# EAGLE design Croduino Pico (EAGLE 7.3.0)
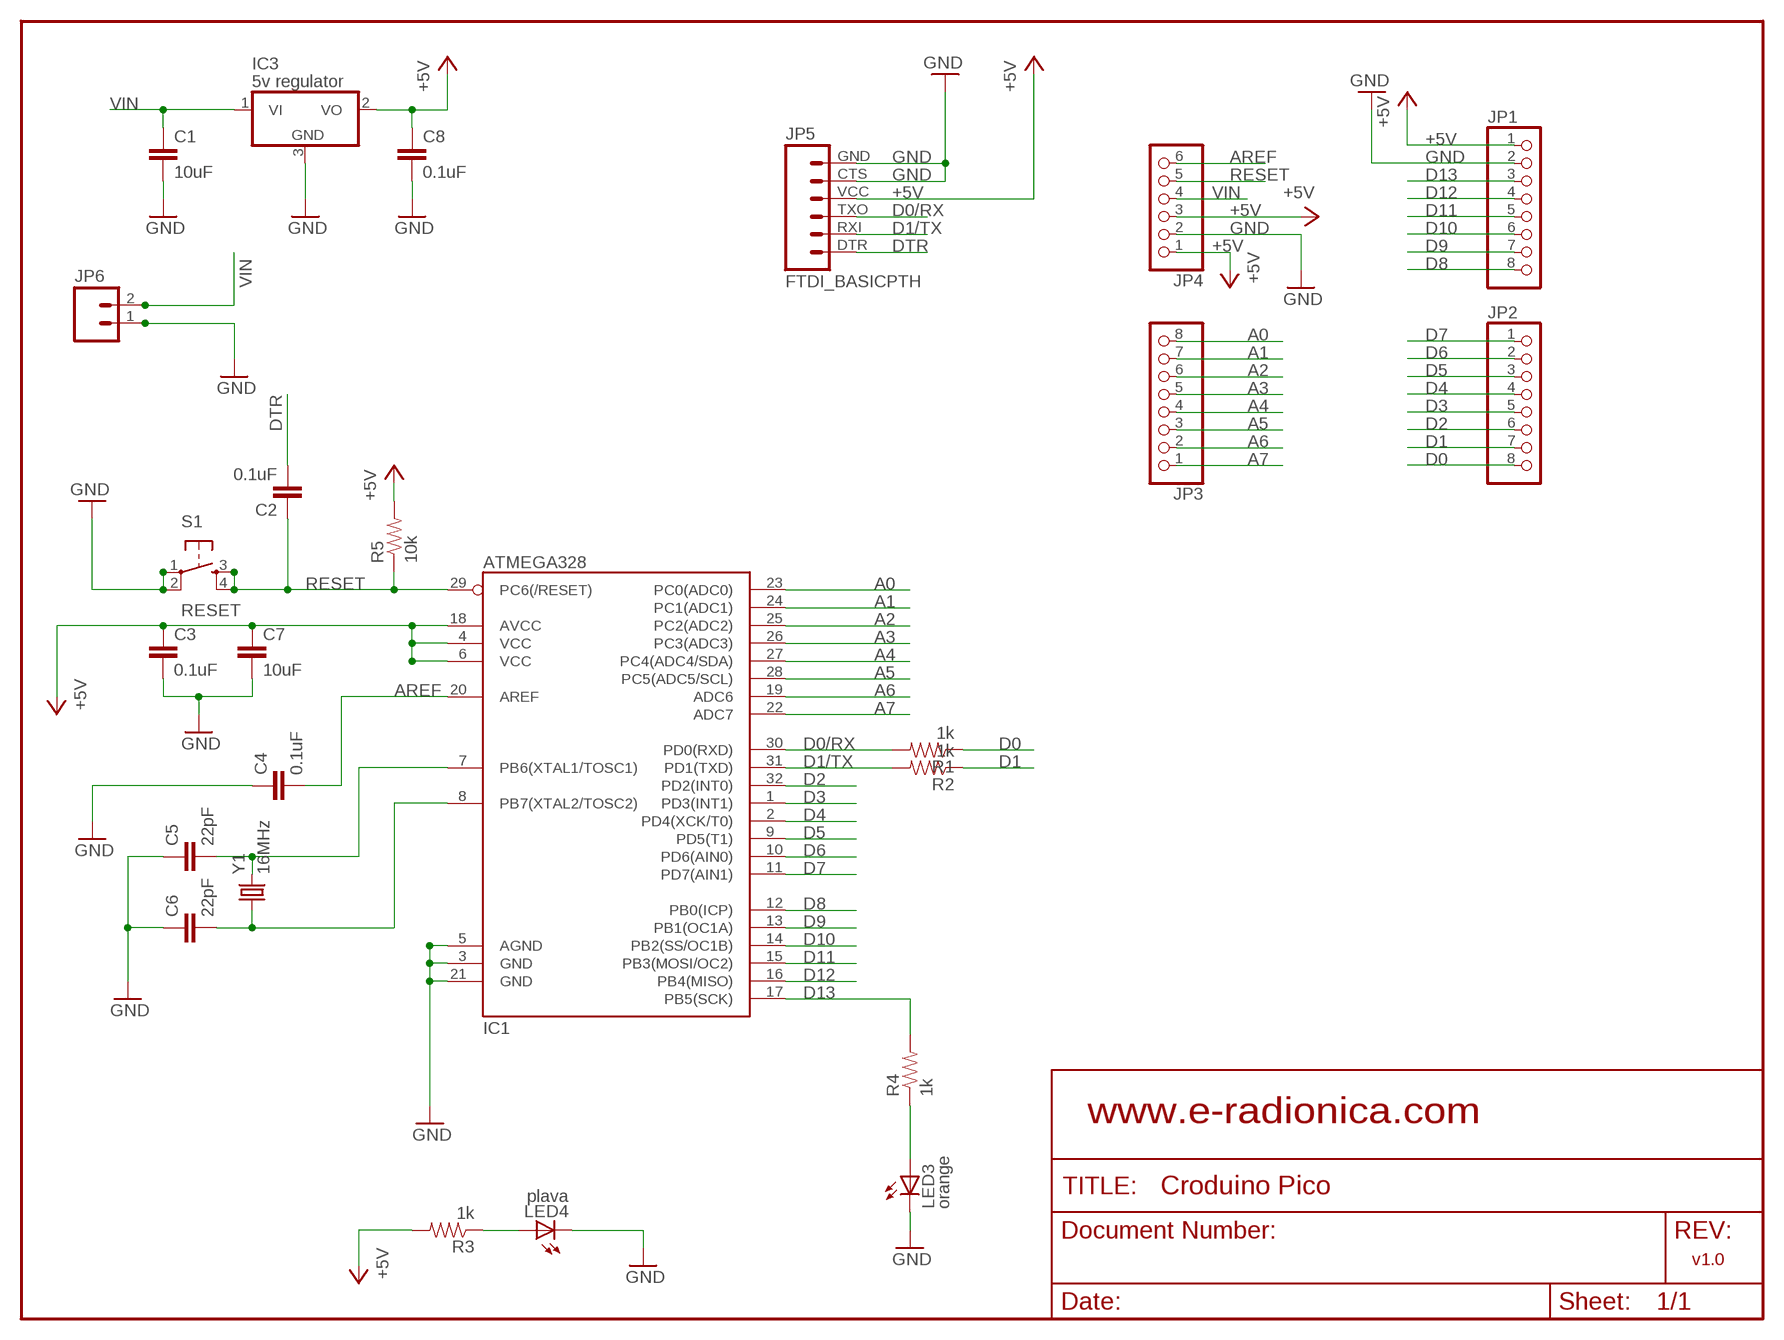
[diagram p0: schematic, sheet 1]

## Parts
C1  10uF  C-EUC3216  [C3216]
C2  0.1uF  CAP0603-CAP  [0603-CAP]
C3  0.1uF  CAP0603-CAP  [0603-CAP]
C4  0.1uF  CAP0603-CAP  [0603-CAP]
C5  22pF  CAP0603-CAP  [0603-CAP]
C6  22pF  CAP0603-CAP  [0603-CAP]
C7  10uF  C-EUC3216  [C3216]
C8  0.1uF  CAP0603-CAP  [0603-CAP]
IC1  ATMEGA328  ATMEGA168  [TQFP32-08]
IC3  5v regulator  7805DT  [TO252]
JP1  PINHD-1X8BIG  [1X08-BIG]
JP2  PINHD-1X8BIG  [1X08-BIG]
JP3  PINHD-1X8BIG  [1X08-BIG]
JP4  PINHD-1X6B  [1X06-BIG]
JP5  FTDI_BASICPTH  [FTDI_BASIC]
JP6  M02LOCK_LONGPADS  [1X02_LOCK_LONGPADS]
LED3  orange  LEDCHIP-LED0805  [CHIP-LED0805]
LED4  plava  LEDCHIP-LED0805  [CHIP-LED0805]
R1  1k  RESISTOR0603-RES  [0603-RES]
R2  1k  RESISTOR0603-RES  [0603-RES]
R3  1k  RESISTOR0603-RES  [0603-RES]
R4  1k  RESISTOR0603-RES  [0603-RES]
R5  10k  RESISTOR0603-RES  [0603-RES]
S1  RESET  TAC_SWITCHSMD  [TACTILE_SWITCH_SMD]
Y1  16MHz  CRYSTAL5X3  [CRYSTAL-SMD-5X3]

## Nets
+5V: C3.1 C7.1 C8.1 IC1.4(VCC) IC1.6(VCC) IC1.18(AVCC) IC3.2(VO) JP1.1 JP4.1 JP4.3 JP5.VCC R3.2 R5.2
A0: IC1.23(PC0(ADC0)) JP3.8
A1: IC1.24(PC1(ADC1)) JP3.7
A2: IC1.25(PC2(ADC2)) JP3.6
A3: IC1.26(PC3(ADC3)) JP3.5
A4: IC1.27(PC4(ADC4/SDA)) JP3.4
A5: IC1.28(PC5(ADC5/SCL)) JP3.3
A6: IC1.19(ADC6) JP3.2
A7: IC1.22(ADC7) JP3.1
AREF: C4.2 IC1.20(AREF) JP4.6
CRYSTAL1: C5.2 IC1.7(PB6(XTAL1/TOSC1)) Y1.3
CRYSTAL2: C6.2 IC1.8(PB7(XTAL2/TOSC2)) Y1.1
D0: JP2.8 R1.1
D0/RX: IC1.30(PD0(RXD)) JP5.TXO R1.2
D1: JP2.7 R2.1
D1/TX: IC1.31(PD1(TXD)) JP5.RXI R2.2
D2: IC1.32(PD2(INT0)) JP2.6
D3: IC1.1(PD3(INT1)) JP2.5
D4: IC1.2(PD4(XCK/T0)) JP2.4
D5: IC1.9(PD5(T1)) JP2.3
D6: IC1.10(PD6(AIN0)) JP2.2
D7: IC1.11(PD7(AIN1)) JP2.1
D8: IC1.12(PB0(ICP)) JP1.8
D9: IC1.13(PB1(OC1A)) JP1.7
D10: IC1.14(PB2(SS/OC1B)) JP1.6
D11: IC1.15(PB3(MOSI/OC2)) JP1.5
D12: IC1.16(PB4(MISO)) JP1.4
D13: IC1.17(PB5(SCK)) JP1.3 R4.2
DTR: C2.2 JP5.DTR
GND: C1.2 C3.2 C4.1 C5.1 C6.1 C7.2 C8.2 IC1.3(GND) IC1.5(AGND) IC1.21(GND) IC3.3(GND) JP1.2 JP4.2 JP5.CTS JP5.GND JP6.1 LED3.C LED4.C S1.1 S1.2
N$4: LED3.A R4.1
N$7: LED4.A R3.1
RESET: C2.1 IC1.29(PC6(/RESET)) JP4.5 R5.1 S1.3 S1.4
VIN: C1.1 IC3.1(VI) JP4.4 JP6.2

## Notes on the sheet
- www.e-radionica.com
- v1.0

## Library data of the parts
C1 C7 = rcl:C-EU: CAPACITOR, European symbol
C2-C6 C8 = SparkFun:CAP: Capacitor Standard 0603 ceramic capacitor, and 0.1" leaded capacitor.
IC1 = SparkFun:ATMEGA168
IC3 = adafruit:78*: Positive VOLTAGE REGULATOR Added bigger pads to the TO-92 package
JP1-JP3 = adafruit:PINHD-1X8: PIN HEADER
JP4 = adafruit:PINHD-1X6: PIN HEADER
JP5 = SparkFun:FTDI_BASIC: FTDI Basic: 3.3V and 5V
JP6 = SparkFun:M02: Header 2 Standard 2-pin 0.1" header. Use with straight break away headers (SKU : PRT-00116), right angle break away headers (PRT-00553), swiss pins (PRT-00743), machine pins (PRT-00117), and female headers (PRT-00115). Molex polarized connector foot print use with SKU : PRT-08233 with associated crimp pins and housings.
LED3 LED4 = adafruit:LED: LED OSRAM: - CHIPLED LG R971, LG N971, LY N971, LG Q971, LY Q971, LO R971, LY R971 LH N974, LH R974 LS Q976, LO Q976, LY Q976 LO Q996 - Hyper CHIPLED LW Q18S LB Q993, LB Q99A, LB R99A - SideLED LS A670, LO A670, LY A670, LG A670, LP A670 LB A673, LV A673, LT A673, LW A673 LH A674 LY A675 LS A676, LA A676, LO A676, LY A676, LW A676 LS A679, LY A679, LG A679 - Hyper Micro SIDELED® LS Y876, LA Y876, LO Y876, LY Y876 LT Y87S - SmartLED LW L88C, LW L88S LB L89C, LB L89S, LG L890 LS L89K, LO L89K, LY L89K LS L896, LA L896, LO L896, LY L896 - TOPLED LS T670, LO T670, LY T670, LG T670, LP T670 LSG T670, LSP T670, LSY T670, LOP T670, LYG T670 LG T671, LOG T671, LSG T671 LB T673, LV T673, LT T673, LW T673 LH T674 LS T676, LA T676, LO T676, LY T676, LB T676, LH T676, LSB T676, LW T676 LB T67C, LV T67C, LT T67C, LS T67K, LO T67K, LY T67K, LW E67C LS E67B, LA E67B, LO E67B, LY E67B, LB E67C, LV E67C, LT E67C LW T67C LS T679, LY T679, LG T679 LS T770, LO T770, LY T770, LG T770, LP T770 LB T773, LV T773, LT T773, LW T773 LH T774 LS E675, LA E675, LY E675, LS T675 LS T776, LA T776, LO T776, LY T776, LB T776 LHGB T686 LT T68C, LB T68C - Hyper Mini TOPLED® LB M676 - Mini TOPLED Santana® LG M470 LS M47K, LO M47K, LY M47K Source: http://www.osram.convergy.de/
R1-R5 = SparkFun:RESISTOR: Resistor Basic schematic elements and footprints for 0603, 1206, and PTH resistors.
S1 = SparkFun:TAC_SWITCH: Momentary Switch Button commonly used for reset or general input. Spark Fun Electronics SKU : COM-00097
Y1 = SparkFun:CRYSTAL: Crystals Various standard crystals. Proven footprints. Spark Fun Electronics SKU : COM-00534

## Board
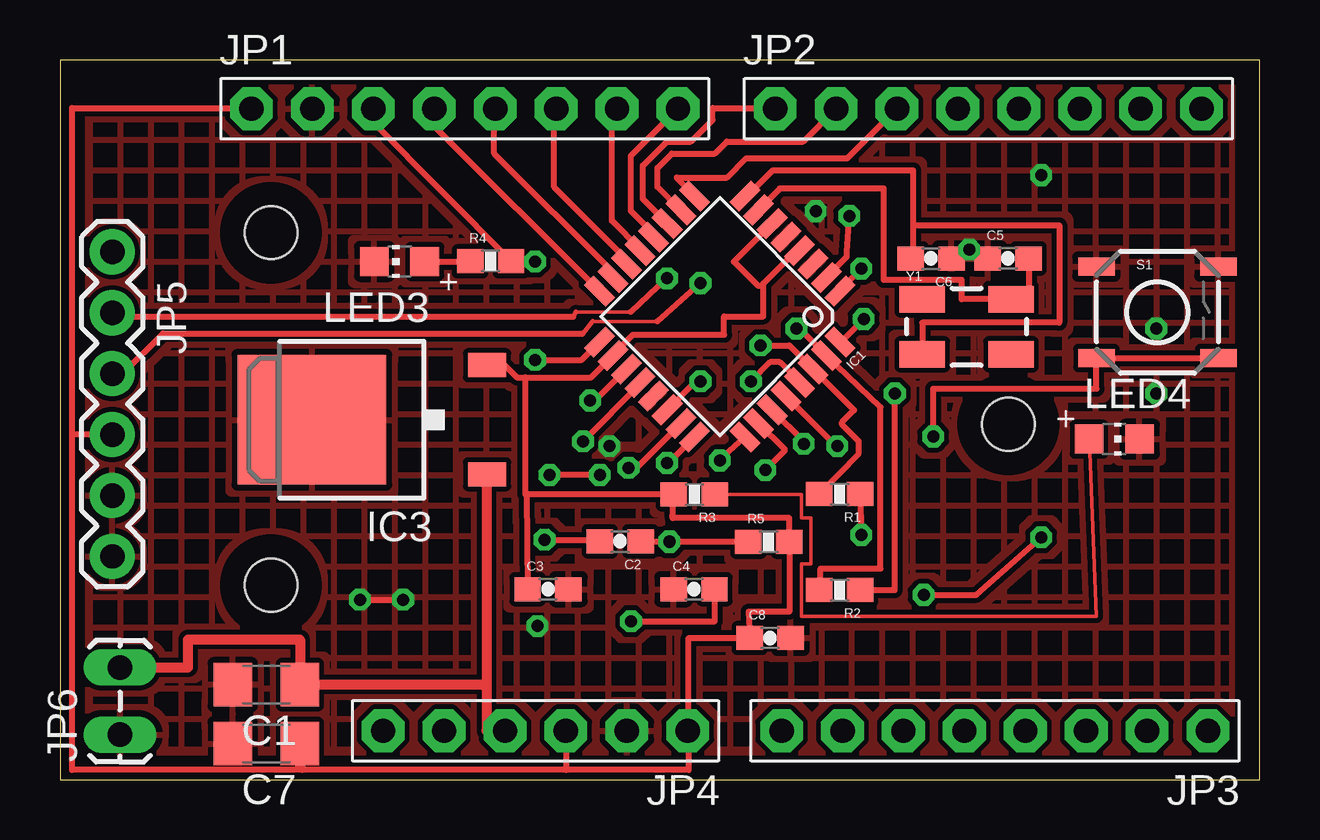
[diagram p1: board, top side]
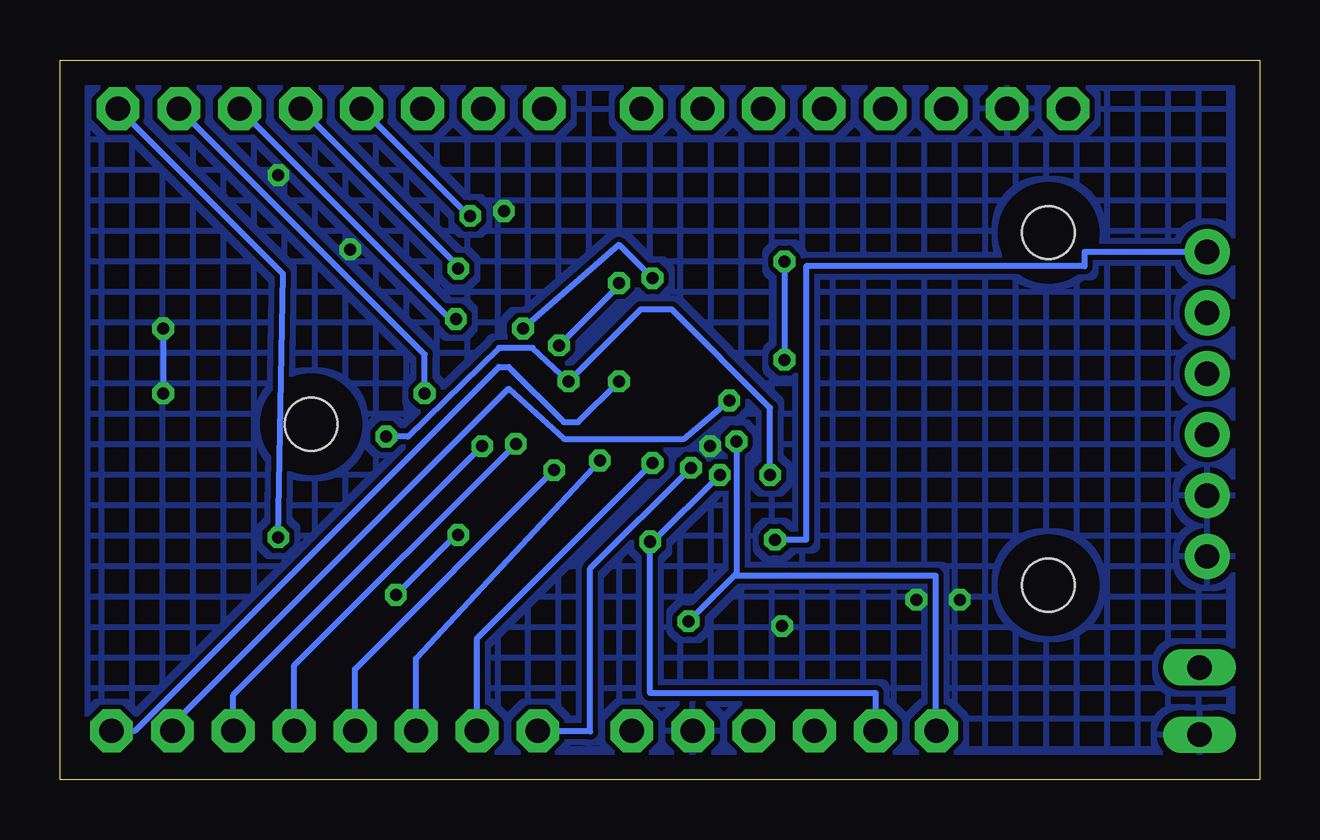
[diagram p2: board, bottom side, seen from below]

Size 50 x 30 mm. Coordinates in mm from the lower left corner, seen from the top.
Outline: 0,0 50,0 50,30 0,30 0,0
Copper layers (1*16): Top 0.035mm / dielectric 1.5mm / Bottom 0.035mm
Design rules "default": minimum track width 10mil, minimum drill 24mil, track to track 8mil, track to pad 8mil, pad to pad 8mil, via to via 8mil, smd to smd 8mil, copper to edge 40mil, drill to drill 8mil, minimum pad ring 10mil, minimum via ring 8mil, stop-mask expansion 4mil, vias tented up to drill 0mil, thermal gap 10mil
Holes 2.2 mm at 8.8,8.1 8.8,22.8 39.53,14.81

### Footprints (pad centres in the part's own frame; a part is rotated, then mirrored left to right if it is on the bottom)
C3216 = smd 1.6 x 1.8: 1 -1.4,0; 2 1.4,0
0603-CAP = smd 1.1 x 1: 1 -0.85,0; 2 0.85,0
TQFP32-08 = smd 1.27 x 0.559: 1 -4.293,2.8; 2 -4.293,2; 3 -4.293,1.2; 4 -4.293,0.4; 5 -4.293,-0.4; 6 -4.293,-1.2; 7 -4.293,-2; 8 -4.293,-2.8; 17 4.293,-2.8; 18 4.293,-2; 19 4.293,-1.2; 20 4.293,-0.4; 21 4.293,0.4; 22 4.293,1.2; 23 4.293,2; 24 4.293,2.8 | smd 0.559 x 1.27: 9 -2.8,-4.293; 10 -2,-4.293; 11 -1.2,-4.293; 12 -0.4,-4.293; 13 0.4,-4.293; 14 1.2,-4.293; 15 2,-4.293; 16 2.8,-4.293; 25 2.8,4.293; 26 2,4.293; 27 1.2,4.293; 28 0.4,4.293; 29 -0.4,4.293; 30 -1.2,4.293; 31 -2,4.293; 32 -2.8,4.293
TO252 = smd 1 x 1.6: 1 -2.28,-4.8; 2 2.28,-4.8 | smd 5.4 x 6.2: 3 0,2.5
1X08-BIG = drill 1.016 pad 1.778 octagon: 1 -8.89,0; 2 -6.35,0; 3 -3.81,0; 4 -1.27,0; 5 1.27,0; 6 3.81,0; 7 6.35,0; 8 8.89,0
1X06-BIG = drill 1.016 pad 1.778 octagon: 1 -6.35,0; 2 -3.81,0; 3 -1.27,0; 4 1.27,0; 5 3.81,0; 6 6.35,0
FTDI_BASIC = drill 1.016 pad 1.88: CTS 10.16,0; DTR 0,0; GND 12.7,0; RXI 2.54,0; TXO 5.08,0; VCC 7.62,0
1X02_LOCK_LONGPADS = drill 1.016 long: 1 -0.127,0; 2 2.667,0
CHIP-LED0805 = smd 1.2 x 1.2: A 0,-1.05; C 0,1.05
0603-RES = smd 1.1 x 1: 1 -0.85,0; 2 0.85,0
TACTILE_SWITCH_SMD = smd 1.524 x 0.762: 1 -2.54,1.905; 2 2.54,1.905; 3 -2.54,-1.905; 4 2.54,-1.905
CRYSTAL-SMD-5X3 = smd 1.9 x 1.1: 1 -1.85,-1.15; 2 1.85,-1.15; 3 1.85,1.15; 4 -1.85,1.15

### Placement (x,y rotation side)
C1  8.6,3.96 180 top
C2  23.35,9.93 180 top
C3  20.34,7.93 0 top
C4  26.43,7.93 0 top
C5  39.52,21.72 0 top
C6  36.31,21.72 180 top
C7  8.6,1.5 180 top
C8  29.6,5.9 0 top
IC1  27.5,19.3 225 top
IC3  13,15 90 top
JP1  16.87,27.97 0 top
JP2  38.7,27.97 0 top
JP3  38.97,2.03 180 top
JP4  19.82,2.03 180 top
JP5  2.18,22 270 top
JP6  2.5,2 90 top
LED3  14.15,21.6 90 top
LED4  43.95,14.19 270 top
R1  32.5,11.9 180 top
R2  32.5,7.9 180 top
R3  26.44,11.89 180 top
R4  17.95,21.61 0 top
R5  29.54,9.91 0 top
S1  45.75,19.48 0 top
U$1  [PICOO]  34.3,5.1 0 top
U$2  [UTICNICA3MM]  46.4,10.7 0 top
Y1  37.79,18.88 0 top

### Tracks (layer width: path | path; a pad name or v marks a point on that pad's centre or on a via)
+5V
  Top 0.254: IC3.2 18.53,17.28 19.05,16.76 19.4,16.76 | 19.4,16.76 22.14,16.76 IC1.18 23.05,17.72 23.88,18.54 27.69,18.54 27.69,19.3 29.32,19.3 29.32,20.68 | IC1.6 28.09,21.59 29.11,20.57 29.21,20.57 29.32,20.68 | IC1.4 30.69,22.05 29.32,20.68 | R5.2 30.4,10.9 25.54,10.9 R3.2 19.44,11.89 | R5.2 | R5.2 30.4,7 28.7,7 C8.1 26.2,5.9 26.2,2.03 | JP5.VCC 0.5,14.38 | 0.5,14.38 0.5,28 7.98,28 JP1.1 | JP4.3 21.1,0.4 | 21.1,0.4 10.1,0.4 | 10.1,0.4 0.5,0.4 0.5,14.38 | JP4.1 26.2,2.03 | 26.2,2.03 26.2,0.4 21.1,0.4 | 19.4,16.76 19.4,11.89 19.44,11.89 | 19.44,11.89 C3.1 | 10,0.5 10.1,0.4
  Top 0.406: C7.1 10,0.5
A0  (via drill 0.5)
  Top 0.254: v23.7,13 24.03,13 IC1.23
  Bottom 0.254: JP3.8 27.93,2.03 27.9,2 27.9,8.8 v23.7,13
A1  (via drill 0.5)
  Top 0.254: v25.3,13.2 25.36,13.2 IC1.24
  Bottom 0.254: JP3.7 32.62,5.88 v25.3,13.2
A2  (via drill 0.5)
  Top 0.254: v27.5,13.3 27.47,13.3 IC1.25
  Bottom 0.254: JP3.6 35.16,5.04 v27.5,13.3
A3  (via drill 0.5)
  Top 0.254: v29.4,12.9 30.2,13.7 30.2,13.77 IC1.26
  Bottom 0.254: JP3.5 37.7,4.6 v29.4,12.9
A4  (via drill 0.5)
  Top 0.254: v31,14 31,14.1 IC1.27
  Bottom 0.254: JP3.4 40.24,4.76 v31,14
A5  (via drill 0.5)
  Top 0.254: v32.4,13.9 32.33,13.9 IC1.28
  Bottom 0.254: JP3.3 42.78,3.52 v32.4,13.9
A6  (via drill 0.5)
  Top 0.254: v22.1,15.8 22.3,15.8 IC1.19
  Bottom 0.254: JP3.2 45.32,2.28 31.3,16.3 29,14.2 24,14.2 v22.1,15.8
A7  (via drill 0.5)
  Top 0.254: v26.7,16.6 26.5,16.6 IC1.22
  Bottom 0.254: JP3.1 46.87,2.03 31.7,17.2 31.3,17.2 29,14.9 28.4,14.9 v26.7,16.6
AREF  (via drill 0.5)
  Top 0.254: IC1.20 24.18,16.48 v21.8,14.1 | v23.8,6.6 27.3,6.6 27.3,7.9 C4.2
  Bottom 0.254: v21.8,14.1 21.8,8.6 | 21.8,8.6 v23.8,6.6 | JP4.6 13.5,2.03 13.5,8.5 21.8,8.5 21.8,8.6
CRYSTAL1
  Top 0.254: C5.2 40.39,21.47 40.39,20.07 39.64,20.07 Y1.3 37.59,20.03 37.59,20.83 34.34,20.83 34.34,24.64 30.01,24.64 IC1.7
CRYSTAL2
  Top 0.254: IC1.8 28.63,24.32 29.72,25.4 35.56,25.4 35.56,23.11 | 35.56,23.11 35.56,21.82 | 35.56,21.82 C6.2 35.56,21.72 35.56,21.82 | 35.56,23.11 41.66,23.11 41.66,19.05 35.94,19.05 Y1.1
D0  (via drill 0.5)
  Top 0.254: R1.1 v33.4,10.2 | v36,7.7 38.2,7.7 v40.9,10.1
  Bottom 0.254: v33.4,10.2 33.5,10.2 v36,7.7 | v40.9,10.1 40.7,21.08 JP2.8
D0/RX  (via drill 0.5)
  Top 0.154: 22.2,19.1 24.9,19.1
  Top 0.2: 21.8,18.6 22.2,19.1
  Top 0.254: JP5.TXO 2.62,16.92 4.3,18.6 21.8,18.6 | 24.9,19.1 v26.7,20.7 | v29.2,18.1 30.4,18.1 IC1.30 32.9,15.6 33.1,15.4 32.6,14.9 32.6,14.8 33.3,14.1 33.3,13.6 R1.2
  Bottom 0.254: v26.7,20.7 27,20.3 v29.2,18.1
D1  (via drill 0.5)
  Top 0.254: R2.1 34.8,7.9 v34.8,16.1
  Bottom 0.254: v34.8,16.1 34.8,17.72 JP2.7
D1/TX  (via drill 0.5)
  Top 0.154: 21.5,19.5 23.8,19.5
  Top 0.2: 21.4,19.3 21.5,19.5
  Top 0.254: v30.7,18.8 30.83,18.8 IC1.31 34.2,15.53 34.2,8.8 31.7,8.8 31.7,7.9 R2.2 | JP5.RXI 2.34,19.3 21.4,19.3 | 23.8,19.5 v25.3,20.9
  Bottom 0.254: v25.3,20.9 26.7,22.3 v30.7,18.8
D2  (via drill 0.5)
  Top 0.254: IC1.32 32.55,18.25 v33.5,19.2
  Bottom 0.254: v33.5,19.2 33.74,19.2 JP2.6
D3  (via drill 0.5)
  Top 0.254: IC1.1 32.52,20.41 v33.4,21.3
  Bottom 0.254: v33.4,21.3 33.3,21.3 JP2.5
D4  (via drill 0.5)
  Top 0.254: IC1.2 31.95,20.95 32.8,21.8 32.8,22 v32.9,23.5
  Bottom 0.254: v32.9,23.5 33.26,23.8 JP2.4
D5
  Top 0.254: IC1.9 26.45,24.36 25.7,25.1 27.8,25.1 28.6,25.9 32.82,25.9 JP2.3
D6
  Top 0.254: IC1.10 25.85,23.75 24.9,24.7 24.9,25.5 25.5,26.1 27.3,26.1 27.8,26.6 30.98,26.6 JP2.2
D7
  Top 0.254: IC1.11 24.3,24.2 24.3,25.6 25.3,26.6 26.3,26.6 27.2,27.5 27.2,28 29.78,28 JP2.1
D8
  Top 0.254: IC1.12 24.75,22.75 23.8,23.7 23.8,26.01 JP1.8
D9
  Top 0.254: IC1.13 24.18,22.12 23,23.3 23,27.75 JP1.7
D10
  Top 0.254: IC1.14 23.62,21.68 20.6,24.7 20.6,27.89 JP1.6
D11
  Top 0.254: IC1.15 23.05,21.15 18.1,26.1 18.1,27.93 JP1.5
D12
  Top 0.254: JP1.4 15.6,27.24 IC1.16
D13  (via drill 0.5)
  Top 0.254: JP1.3 13.06,27.4 R4.2 v19.8,21.61 v19.8,21.6 | v19.8,17.5 21.74,17.5 IC1.17
  Bottom 0.254: v19.8,21.6 v19.8,17.5
DTR  (via drill 0.5)
  Top 0.254: v20.2,10 22.45,10 C2.2
  Bottom 0.254: JP5.DTR 7.3,22 7.3,21.4 18.9,21.4 18.9,10 v20.2,10
GND  (via drill 0.5)
  Top 0.254: v12.5,7.5 v14.3,7.5
  Bottom 0.254: v45.7,18.8 v45.7,16.1
  other vias: 19.9,6.4 22.9,13.9 31.5,23.7 37.9,22.1 40.9,25.2
  pour Bottom (isolate 0.2, hatched): 0,0 0,30 50,30 50,0
  pour Top (isolate 0.2, hatched): 0,0 0,30 50,30 50,0
N$4
  Top 0.254: LED3.A 17.04,21.6 R4.1
N$7
  Top 0.154: R3.1 30.9,11.89 30.9,10.9 31.3,10.9 31.3,9 30.9,9 30.9,6.8 43.2,6.8 LED4.A
RESET  (via drill 0.5)
  Top 0.254: S1.4 S1.3 43.2,16.3 36.4,16.3 v36.4,14.3 | C2.1 v25.4,9.93 28.64,9.93 R5.1 v25.41,9.91 v25.4,9.9 | IC1.29 30.82,16.58 30,17.4 29.6,17.4 v28.8,16.6 | v22.5,12.7 v20.4,12.7
  Bottom 0.254: JP4.5 16,3.6 25.4,3.6 v25.4,9.9 | v25.4,9.9 v25.4,9.93 | v36.4,14.3 35.5,14.3 31.7,18 30.3,18 v28.8,16.6 25.8,19.6 24.5,19.6 20.4,15.5 v20.4,12.7 | v25.4,9.9 25.3,9.9 v22.5,12.7
VIN
  Top 0.406: IC3.1 17.78,12.72 17.78,3.96 | JP4.4 17.78,2.03 17.78,3.8 17.78,3.96 | JP6.2 5.33,4.67 5.33,5.84 10,5.84 C1.1 17.78,3.96

### Text on the board
200bmp: 13 | 12 | 11' | 10' | 9' | 8 | 7 | 6' | 5' | 4 | 3' | 2 | 1 | 0 | grn | +5V | gnd | digital | digital | tx | rx | rst | tx | 16MHz | RESET | rx | ATMEGA328 | 5V | gnd | gnd | blk | analog | aref | rst | VIN | +5V | gnd | +5V | 0 | 1 | 2 | 3 | 4 | 5 | 6 | 7 | + | 7-32V | /Users/David/pcb.bmp | -